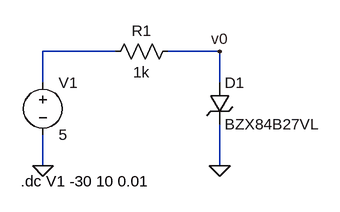
[diagram p0: schematic BZX84B27VL.asc]
BZX84B27VL.asc, the LTspice schematic file:
Version 4
SHEET 1 880 680
WIRE 176 80 64 80
WIRE 336 80 256 80
WIRE 64 128 64 80
WIRE 336 128 336 80
WIRE 64 256 64 208
WIRE 336 256 336 192
FLAG 64 256 0
FLAG 336 256 0
FLAG 336 80 v0
SYMBOL voltage 64 112 R0
WINDOW 123 0 0 Left 0
WINDOW 39 0 0 Left 0
SYMATTR InstName V1
SYMATTR Value 5
SYMBOL res 272 64 R90
WINDOW 0 0 56 VBottom 2
WINDOW 3 32 56 VTop 2
SYMATTR InstName R1
SYMATTR Value 1k
SYMBOL zener 320 128 R0
SYMATTR InstName D1
SYMATTR Value BZX84B27VL
SYMATTR Description Diode
SYMATTR Type diode
TEXT 30 280 Left 2 !.dc V1 -30 10 0.01

The netlist it stands for:
* BZX84B27VL.asc
V1 N001 0 5
R1 v0 N001 1k
D1 v0 0 BZX84B27VL
.model D D
.lib standard.dio
.dc V1 -30 10 0.01
.backanno
.end

* Results of the author's LTspice run, read from the files saved beside the schematic
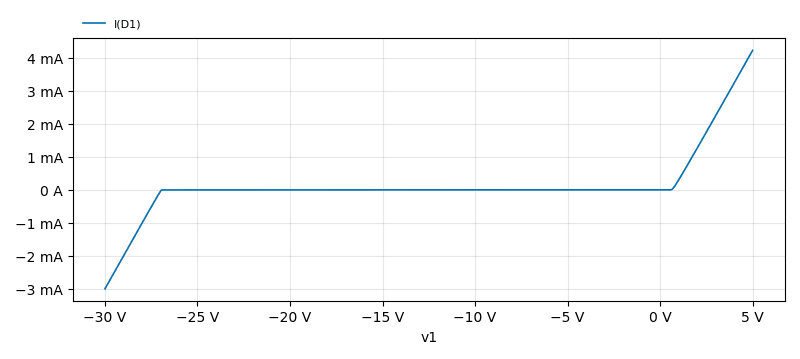
[diagram p1: DC transfer characteristic of BZX84B27VL.asc, plotted from the saved traces]
* DC transfer characteristic, 1 run:
*   I(D1): -2.995 mA at v1=-30 V, 4.228 mA at v1=5 V, min -2.995 mA, max 4.228 mA